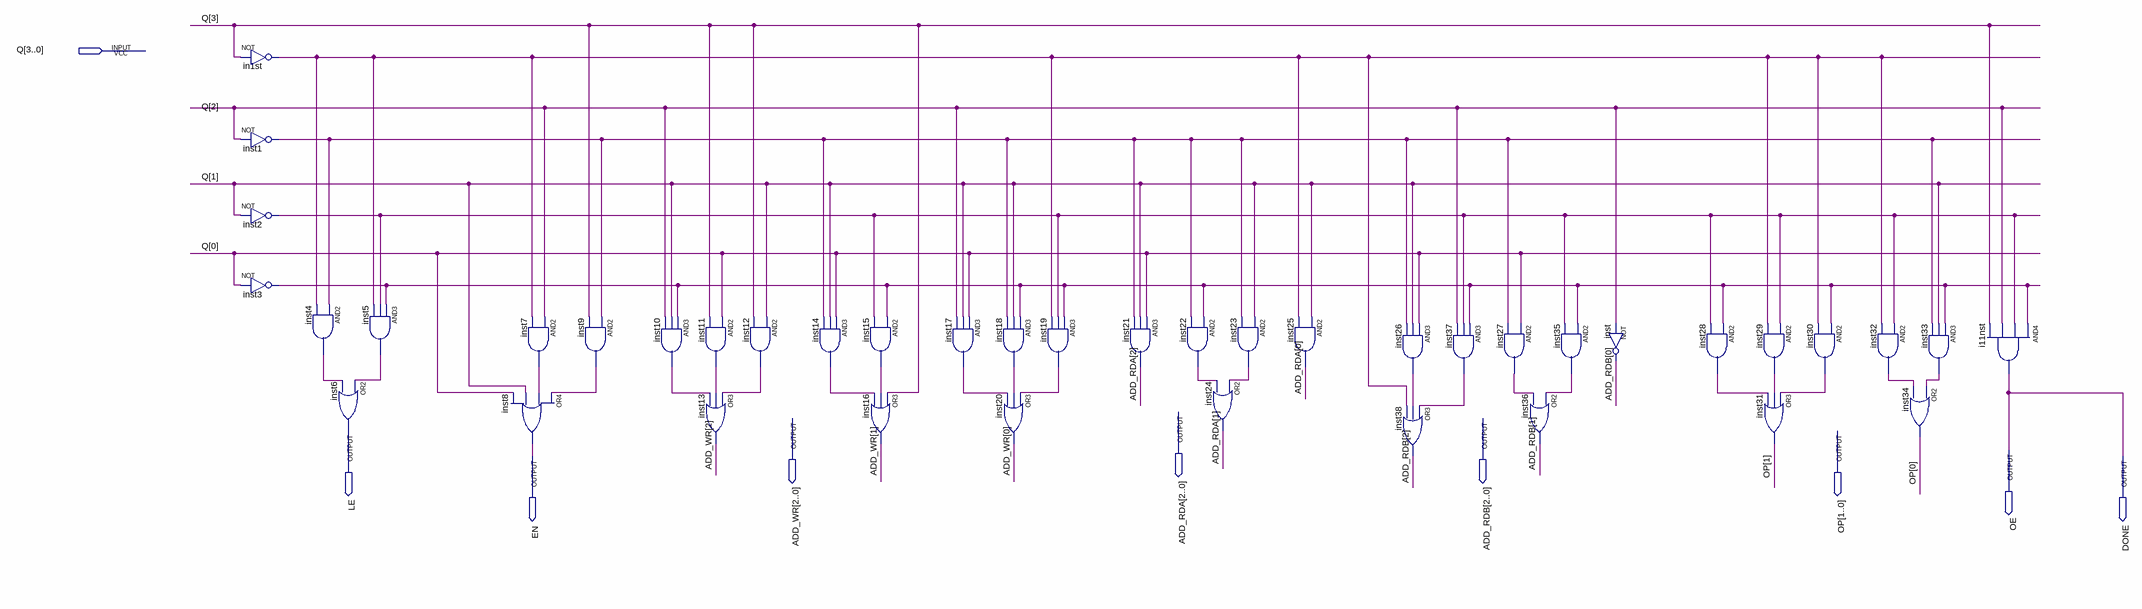
[diagram p0: schematic sheet]
// Quartus schematic ENCODER.bdf as structural Verilog: 41 symbols, 9 pins
module ENCODER (
  input  [3:0] Q,
  output [2:0] ADD_RDA,
  output [2:0] ADD_WR,
  output [2:0] ADD_RDB,
  output LE,
  output [1:0] OP,
  output OE,
  output EN,
  output DONE
);

  wire in1st_out, inst1_out, inst2_out, inst3_out, inst4_out, inst5_out, inst7_out, inst9_out, inst10_out,
       inst11_out, inst12_out, inst14_out, inst15_out, inst17_out, inst18_out, inst19_out, inst22_out,
       inst23_out, inst26_out, inst27_out, inst28_out, inst29_out, inst30_out, inst32_out, inst33_out,
       inst35_out, inst37_out;

  not in1st (in1st_out, Q[3]);
  not inst1 (inst1_out, Q[2]);
  not inst2 (inst2_out, Q[1]);
  not inst3 (inst3_out, Q[0]);
  and inst4 (inst4_out, inst1_out, in1st_out);
  and inst5 (inst5_out, inst3_out, inst2_out, in1st_out);
  or inst6 (LE, inst5_out, inst4_out);
  and inst7 (inst7_out, Q[2], in1st_out);
  or inst8 (EN, inst9_out, inst7_out, Q[1], Q[0]);
  and inst9 (inst9_out, inst1_out, Q[3]);
  and inst10 (inst10_out, inst3_out, Q[1], Q[2]);
  and inst11 (inst11_out, Q[0], Q[3]);
  or inst13 (ADD_WR[2], inst12_out, inst11_out, inst10_out);
  and inst12 (inst12_out, Q[1], Q[3]);
  and inst14 (inst14_out, Q[0], Q[1], inst1_out);
  and inst15 (inst15_out, inst3_out, inst2_out);
  or inst16 (ADD_WR[1], Q[3], inst15_out, inst14_out);
  and inst17 (inst17_out, Q[0], Q[1], Q[2]);
  and inst18 (inst18_out, inst3_out, Q[1], inst1_out);
  or inst20 (ADD_WR[0], inst19_out, inst18_out, inst17_out);
  and inst19 (inst19_out, inst3_out, inst2_out, in1st_out);
  and inst21 (ADD_RDA[2], Q[0], Q[1], inst1_out);
  and inst22 (inst22_out, inst3_out, inst1_out);
  and inst23 (inst23_out, Q[1], inst1_out);
  or inst24 (ADD_RDA[1], inst23_out, inst22_out);
  and inst25 (ADD_RDA[0], Q[1], in1st_out);
  and inst26 (inst26_out, Q[0], Q[1], inst1_out);
  or inst38 (ADD_RDB[2], inst37_out, inst26_out, in1st_out);
  and inst37 (inst37_out, inst3_out, inst2_out, Q[2]);
  and inst27 (inst27_out, Q[0], inst1_out);
  or inst36 (ADD_RDB[1], inst35_out, inst27_out);
  and inst35 (inst35_out, inst3_out, inst2_out);
  not inst (ADD_RDB[0], Q[2]);
  and inst28 (inst28_out, inst3_out, inst2_out);
  and inst29 (inst29_out, inst2_out, in1st_out);
  or inst31 (OP[1], inst30_out, inst29_out, inst28_out);
  and inst30 (inst30_out, inst3_out, in1st_out);
  and inst32 (inst32_out, inst2_out, in1st_out);
  and inst33 (inst33_out, inst3_out, Q[1], inst1_out);
  or inst34 (OP[0], inst33_out, inst32_out);
  and i11nst (DONE, inst3_out, inst2_out, Q[2], Q[3]);

  assign OE = DONE;
endmodule
